# EAGLE design smartwatch (EAGLE 9.7.0)
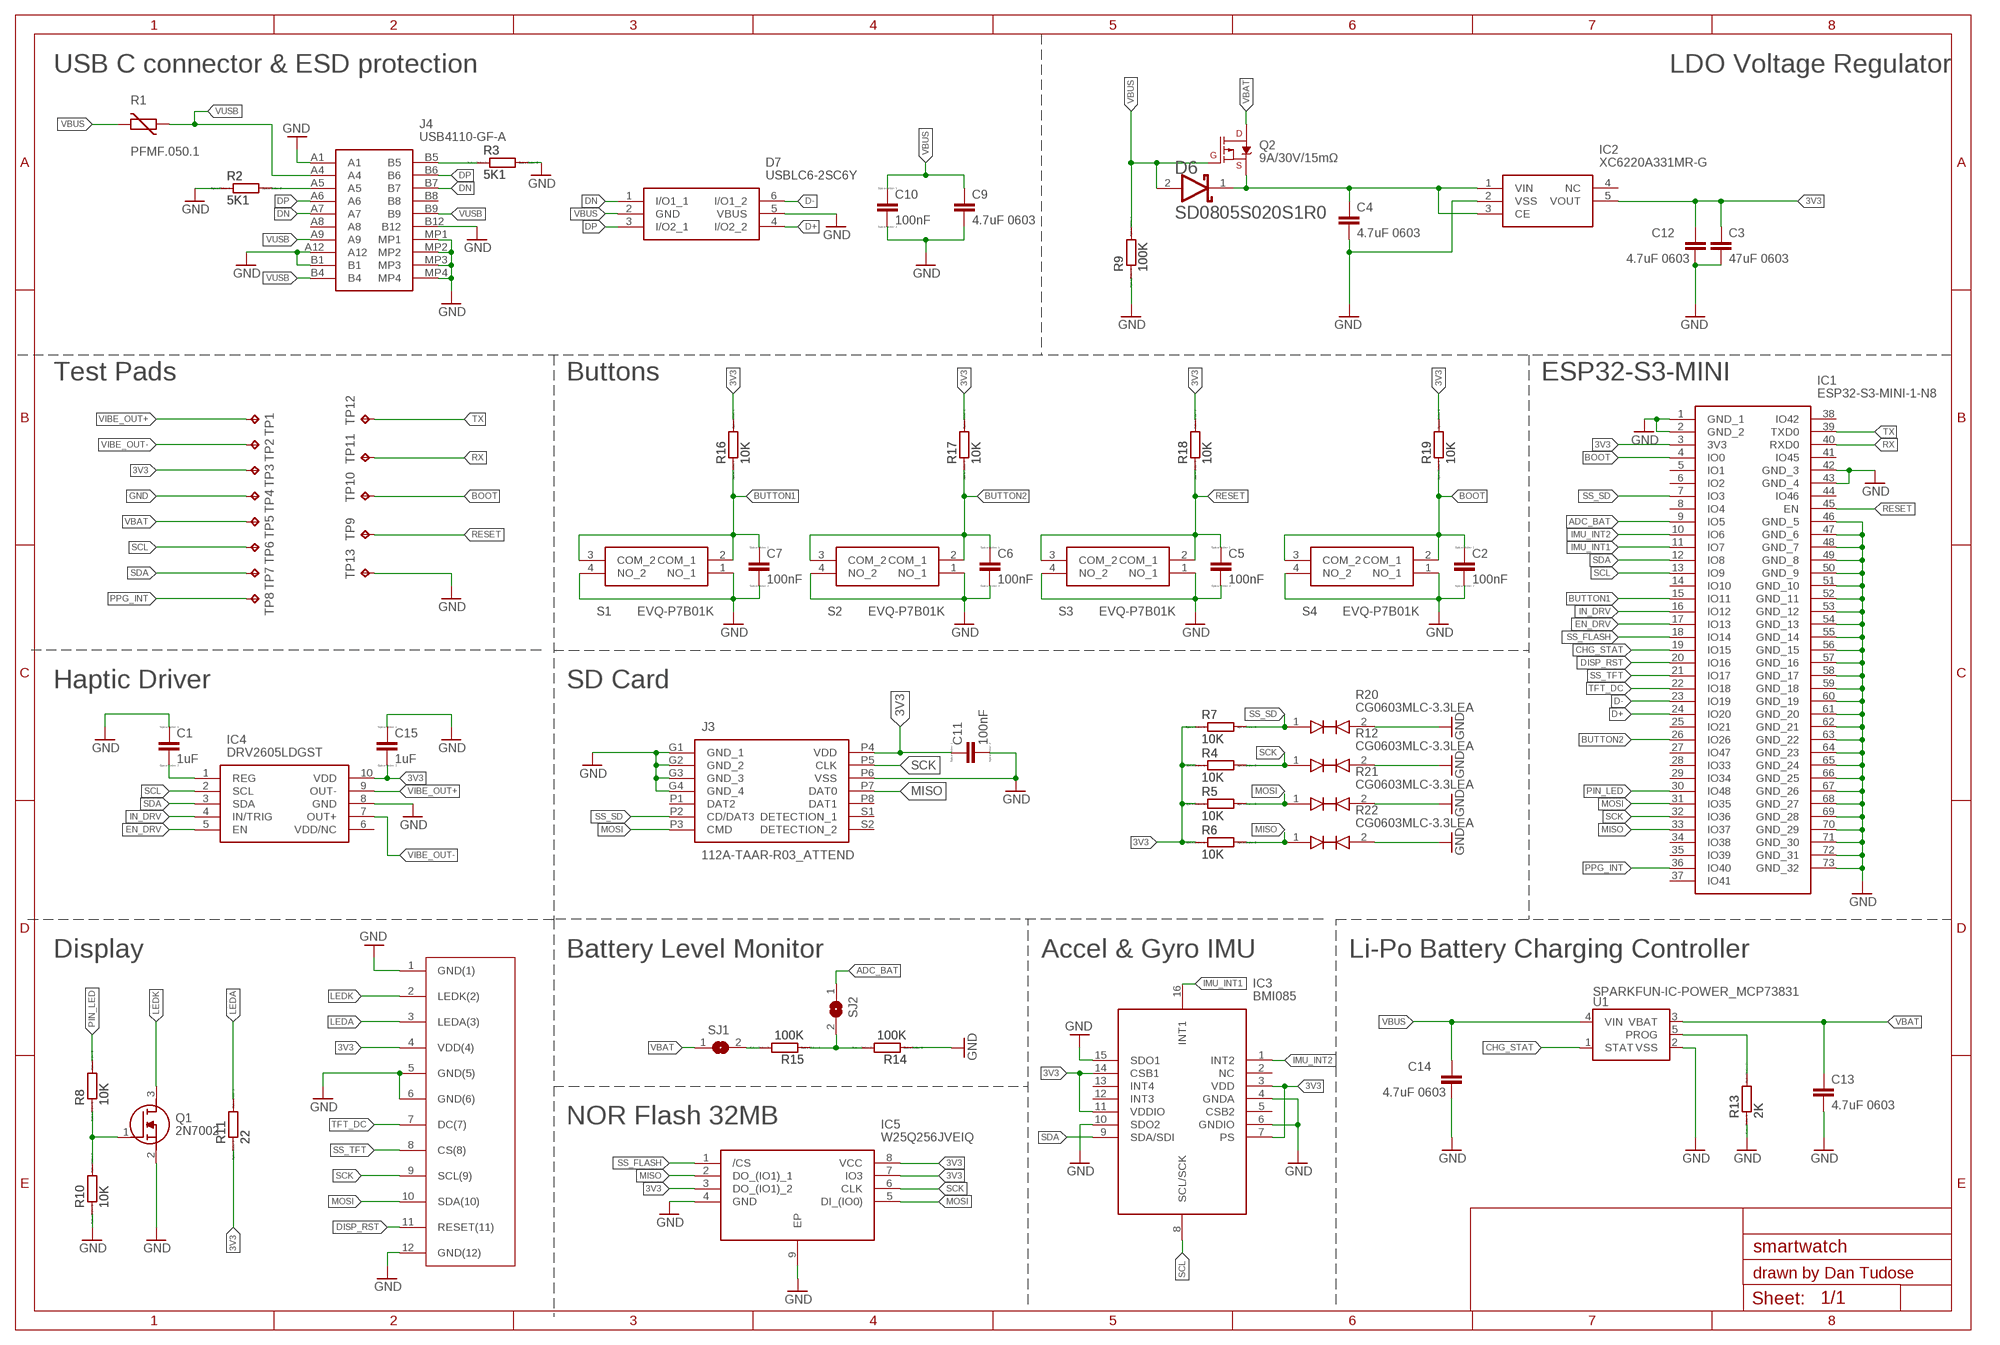
[diagram p0: schematic, sheet 1]

## Parts
C1  1uF  EAGLE-LTSPICE_CC0402  [EAGLE-LTSPICE_C0402]
C2  100nF  EAGLE-LTSPICE_CC0402  [EAGLE-LTSPICE_C0402]
C3  47uF 0603  RCL_C-EUC0603  [RCL_C0603]
C4  4.7uF 0603  RCL_C-EUC0603  [RCL_C0603]
C5  100nF  EAGLE-LTSPICE_CC0402  [EAGLE-LTSPICE_C0402]
C6  100nF  EAGLE-LTSPICE_CC0402  [EAGLE-LTSPICE_C0402]
C7  100nF  EAGLE-LTSPICE_CC0402  [EAGLE-LTSPICE_C0402]
C9  4.7uF 0603  RCL_C-EUC0603  [RCL_C0603]
C10  100nF  EAGLE-LTSPICE_CC0402  [EAGLE-LTSPICE_C0402]
C11  100nF  EAGLE-LTSPICE_CC0402  [EAGLE-LTSPICE_C0402]
C12  4.7uF 0603  RCL_C-EUC0603  [RCL_C0603]
C13  4.7uF 0603  RCL_C-EUC0603  [RCL_C0603]
C14  4.7uF 0603  RCL_C-EUC0603  [RCL_C0603]
C15  1uF  EAGLE-LTSPICE_CC0402  [EAGLE-LTSPICE_C0402]
CON1  LCD_FPC  [LCD_FPC]
D6  AVX---SD0805S020S1R0_AVX_SD0805S020S1R0AVX_SD0805S020S1R0_0_0  [AVX---SD0805S020S1R0_AVX_SD0805S020S1R0_0]
D7  USBLC6-2SC6Y  [SOT95P280X145-6N]
IC1  ESP32-S3-MINI-1-N8  [ESP32S3MINI1N8]
IC2  XC6220A331MR-G  [SOT95P280X120-5N]
IC3  BMI085  [BMI085]
IC4  DRV2605LDGST  [SOP50P490X110-10N]
IC5  W25Q256JVEIQ  [SON127P800X600X80-9N]
J3  112A-TAAR-R03_ATTEND  [112ATAARR03ATTEND]
J4  USB4110-GF-A  [USB4110GFA]
Q1  2N7002  [SOT96P240X120-3N]
Q2  9A/30V/15mΩ  SPARKFUN-DISCRETESEMI_MOSFET_PCH-SI2309DS  [SPARKFUN-DISCRETESEMI_SOT23-3]
R1  PFMF.050.1  VARISTOR_VARISTORCN1812  [VARISTOR_CT/CN1812]
R2  5K1  EAGLE-LTSPICE_RR0402  [EAGLE-LTSPICE_R0402]
R3  5K1  EAGLE-LTSPICE_RR0402  [EAGLE-LTSPICE_R0402]
R4  10K  EAGLE-LTSPICE_RR0402  [EAGLE-LTSPICE_R0402]
R5  10K  EAGLE-LTSPICE_RR0402  [EAGLE-LTSPICE_R0402]
R6  10K  EAGLE-LTSPICE_RR0402  [EAGLE-LTSPICE_R0402]
R7  10K  EAGLE-LTSPICE_RR0402  [EAGLE-LTSPICE_R0402]
R8  10K  EAGLE-LTSPICE_RR0402  [EAGLE-LTSPICE_R0402]
R9  100K  EAGLE-LTSPICE_RR0402  [EAGLE-LTSPICE_R0402]
R10  10K  EAGLE-LTSPICE_RR0402  [EAGLE-LTSPICE_R0402]
R11  22  EAGLE-LTSPICE_RR0402  [EAGLE-LTSPICE_R0402]
R12  CG0603MLC-3.3LEA  [DIONC1608X61N]
R13  2K  EAGLE-LTSPICE_RR0402  [EAGLE-LTSPICE_R0402]
R14  100K  EAGLE-LTSPICE_RR0402  [EAGLE-LTSPICE_R0402]
R15  100K  EAGLE-LTSPICE_RR0402  [EAGLE-LTSPICE_R0402]
R16  10K  EAGLE-LTSPICE_RR0402  [EAGLE-LTSPICE_R0402]
R17  10K  EAGLE-LTSPICE_RR0402  [EAGLE-LTSPICE_R0402]
R18  10K  EAGLE-LTSPICE_RR0402  [EAGLE-LTSPICE_R0402]
R19  10K  EAGLE-LTSPICE_RR0402  [EAGLE-LTSPICE_R0402]
R20  CG0603MLC-3.3LEA  [DIONC1608X61N]
R21  CG0603MLC-3.3LEA  [DIONC1608X61N]
R22  CG0603MLC-3.3LEA  [DIONC1608X61N]
S1  EVQ-P7B01K  [EVQP7B01K]
S2  EVQ-P7B01K  [EVQP7B01K]
S3  EVQ-P7B01K  [EVQP7B01K]
S4  EVQ-P7B01K  [EVQP7B01K]
SJ1  SJ  [SJ]
SJ2  SJ  [SJ]
TP1  TPTP20R  [TP20R]
TP2  TPTP20R  [TP20R]
TP3  TPTP20R  [TP20R]
TP4  TPTP20R  [TP20R]
TP5  TPTP20R  [TP20R]
TP6  TPTP20R  [TP20R]
TP7  TPTP20R  [TP20R]
TP8  TPTP20R  [TP20R]
TP9  TPTP20R  [TP20R]
TP10  TPTP20R  [TP20R]
TP11  TPTP20R  [TP20R]
TP12  TPTP20R  [TP20R]
TP13  TPTP20R  [TP20R]
U1  SPARKFUN-IC-POWER_MCP73831  [SPARKFUN-IC-POWER_SOT23-5]

## Nets
3V3: C3.1 C11.1 C12.1 C15.2 CON1.4(VDD(4)) IC1.3(3V3) IC2.5(VOUT) IC3.3(VDD) IC3.7(PS) IC3.11(VDDIO) IC3.14(CSB1) IC4.10(VDD) IC5.3(DO_(IO1)_2) IC5.7(IO3) IC5.8(VCC) J3.P4(VDD) R4.1 R5.1 R6.1 R7.1 R11.1 R16.2 R17.2 R18.2 R19.2 TP3.TP
ADC_BAT: IC1.9(IO5) SJ2.1
BOOT: C2.1 IC1.4(IO0) R19.1 S4.2(COM_1) S4.3(COM_2) TP10.TP
BUTTON1: C7.1 IC1.15(IO11) R16.1 S1.2(COM_1) S1.3(COM_2)
BUTTON2: C6.1 IC1.26(IO26) R17.1 S2.2(COM_1) S2.3(COM_2)
CHG_STAT: IC1.19(IO15) U1.1(STAT)
D+: D7.4(I/O2_2) IC1.24(IO20)
D-: D7.6(I/O1_2) IC1.23(IO19)
DISP_RST: CON1.11(RESET(11)) IC1.20(IO16)
DN: D7.1(I/O1_1) J4.A7 J4.B7
DP: D7.3(I/O2_1) J4.A6 J4.B6
EN_DRV: IC1.17(IO13) IC4.5(EN)
GND: C1.1 C2.2 C3.2 C4.2 C5.2 C6.2 C7.2 C9.2 C10.2 C11.2 C12.2 C13.2 C14.2 C15.1 CON1.1(GND(1)) CON1.5(GND(5)) CON1.6(GND(6)) CON1.12(GND(12)) D7.5(VBUS) IC1.1(GND_1) IC1.2(GND_2) IC1.42(GND_3) IC1.43(GND_4) IC1.46(GND_5) IC1.47(GND_6) IC1.48(GND_7) IC1.49(GND_8) IC1.50(GND_9) IC1.51(GND_10) IC1.52(GND_11) IC1.53(GND_12) IC1.54(GND_13) IC1.55(GND_14) IC1.56(GND_15) IC1.57(GND_16) IC1.58(GND_17) IC1.59(GND_18) IC1.60(GND_19) IC1.61(GND_20) IC1.62(GND_21) IC1.63(GND_22) IC1.64(GND_23) IC1.65(GND_24) IC1.66(GND_25) IC1.67(GND_26) IC1.68(GND_27) IC1.69(GND_28) IC1.70(GND_29) IC1.71(GND_30) IC1.72(GND_31) IC1.73(GND_32) IC2.2(VSS) IC3.4(GNDA) IC3.6(GNDIO) IC3.10(SDO2) IC3.15(SDO1) IC4.8(GND) IC5.4(GND) IC5.9(EP) J3.G1(GND_1) J3.G2(GND_2) J3.G3(GND_3) J3.G4(GND_4) J3.P6(VSS) J4.A1 J4.A12 J4.B1 J4.B12 J4.MP1 J4.MP2 J4.MP3 J4.MP4 Q1.2(S) R2.1 R3.2 R9.1 R10.1 R12.2 R13.1 R14.1 R20.2 R21.2 R22.2 S1.1(NO_1) S1.4(NO_2) S2.1(NO_1) S2.4(NO_2) S3.1(NO_1) S3.4(NO_2) S4.1(NO_1) S4.4(NO_2) TP4.TP TP13.TP U1.2(VSS)
IMU_INT1: IC1.11(IO7) IC3.16(INT1)
IMU_INT2: IC1.10(IO6) IC3.1(INT2)
IN_DRV: IC1.16(IO12) IC4.4(IN/TRIG)
LEDA: CON1.3(LEDA(3)) R11.2
LEDK: CON1.2(LEDK(2)) Q1.3(D)
MISO: IC1.33(IO37) IC5.2(DO_(IO1)_1) J3.P7(DAT0) R6.2 R22.1
MOSI: CON1.10(SDA(10)) IC1.31(IO35) IC5.5(DI_(IO0)) J3.P3(CMD) R5.2 R21.1
N$1: C1.2 IC4.1(REG)
N$2: C4.1 D6.1(CATHODE) IC2.1(VIN) IC2.3(CE) Q2.2(S)
N$3: J4.A5 R2.2
N$7: R13.2 U1.5(PROG)
N$9: J4.B5 R3.1
N$10: Q1.1(G) R8.1 R10.2
N$14: R14.2 R15.1 SJ2.2
N$16: R15.2 SJ1.2
PIN_LED: IC1.30(IO48) R8.2
PPG_INT: IC1.36(IO40) TP8.TP
RESET: C5.1 IC1.45(EN) R18.1 S3.2(COM_1) S3.3(COM_2) TP9.TP
RX: IC1.40(RXD0) TP11.TP
SCK: CON1.9(SCL(9)) IC1.32(IO36) IC5.6(CLK) J3.P5(CLK) R4.2 R12.1
SCL: IC1.13(IO9) IC3.8(SCL/SCK) IC4.2(SCL) TP6.TP
SDA: IC1.12(IO8) IC3.9(SDA/SDI) IC4.3(SDA) TP7.TP
SS_FLASH: IC1.18(IO14) IC5.1(/CS)
SS_SD: IC1.7(IO3) J3.P2(CD/DAT3) R7.2 R20.1
SS_TFT: CON1.8(CS(8)) IC1.21(IO17)
TFT_DC: CON1.7(DC(7)) IC1.22(IO18)
TX: IC1.39(TXD0) TP12.TP
VBAT: C13.1 Q2.3(D) SJ1.1 TP5.TP U1.3(VBAT)
VBUS: C9.1 C10.1 C14.1 D6.2(ANODE) D7.2(GND) Q2.1(G) R1.2 R9.2 U1.4(VIN)
VIBE_OUT+: IC4.9(OUT-) TP1.TP
VIBE_OUT-: IC4.7(OUT+) TP2.TP
VUSB: J4.A4 J4.A9 J4.B4 J4.B9 R1.1
Unconnected: IC1.5(IO1) IC1.6(IO2) IC1.8(IO4) IC1.14(IO10) IC1.25(IO21) IC1.27(IO47) IC1.28(IO33) IC1.29(IO34) IC1.34(IO38) IC1.35(IO39) IC1.37(IO41) IC1.38(IO42) IC1.41(IO45) IC1.44(IO46) IC2.4(NC) IC3.2(NC) IC3.5(CSB2) IC3.12(INT3) IC3.13(INT4) IC4.6(VDD/NC) J3.P1(DAT2) J3.P8(DAT1) J3.S1(DETECTION_1) J3.S2(DETECTION_2) J4.A8 J4.B8

## Notes on the sheet
- USB C connector & ESD protection | LDO Voltage Regulator
- Test Pads | Buttons | ESP32-S3-MINI
- Haptic Driver | SD Card
- Display | Battery Level Monitor | Accel & Gyro IMU | Li-Po Battery Charging Controller
- NOR Flash 32MB
- drawn by Dan Tudose

## Library data of the parts
C1 C2 C5-C7 C10 C11 C15 = Hector_Watch:EAGLE-LTSPICE_C: CAPACITOR, European symbol; SPICEMODEL: NONE; SPICEPREFIX: C
C3 C4 C9 C12-C14 = Hector_Watch:RCL_C-EU: CAPACITOR, European symbol; SPICEPREFIX: C
CON1 = Hector_Watch:LCD_FPC
D6 = Hector_Watch:AVX---SD0805S020S1R0_AVX_SD0805S020S1R0: Schottky Barrier Rectifier Diode; CENTROID_NOT_SPECIFIED: No; DATASHEET: http://datasheets.avx.com/schottky.pdf; DIGIKEY_DESCRIPTION: DIODE SCHOTTKY 20V 1A 0805; DIGIKEY_PART_NUMBER: 478-7800-1-ND; LEAD_FREE: yes; MF: AVX; MOUSER_PART_NUMBER: 581-SD0805S020S1R0; MPN: SD0805S020S1R0; PACKAGE: 0805 (2012 metric); PREFIX: D; ROHS: yes; TEMPERATURE_RANGE_HIGH: +125°C; TEMPERATURE_RANGE_LOW: -55°C
D7 = Hector_Watch:USBLC6-2SC6Y: Low Cap. ESD Protection Auto SOT-23-6 STMicroelectronics USBLC6-2SC6Y, Dual Uni-Directional TVS Diode Array, 6-Pin SOT-23 Source: Datasheet <https://componentsearchengine.com/Datasheets/1/USBLC6-2SC6Y.pdf>; ARROW_PART_NUMBER: USBLC6-2SC6Y; ARROW_PRICE-STOCK: https://www.arrow.com/en/products/usblc6-2sc6y/stmicroelectronics?region=nac; DESCRIPTION: Low Cap. ESD Protection Auto SOT-23-6 STMicroelectronics USBLC6-2SC6Y, Dual Uni-Directional TVS Diode Array, 6-Pin SOT-23; HEIGHT: 1.45mm; MANUFACTURER_NAME: STMicroelectronics; MANUFACTURER_PART_NUMBER: USBLC6-2SC6Y; MOUSER_PART_NUMBER: 511-USBLC6-2SC6Y; MOUSER_PRICE-STOCK: https://www.mouser.co.uk/ProductDetail/STMicroelectronics/USBLC6-2SC6Y?qs=gNDSiZmRJS%2FOgDexvXkdow%3D%3D
IC1 = Hector_Watch:ESP32-S3-MINI-1-N8: WiFi Development Tools - 802.11 [Engineering Samples] SMD Module, ESP32-S3FN8, 8 MB SPI Flash, PCB Antenna Source: Datasheet <https://www.espressif.com/sites/default/files/documentation/esp32-s3-mini-1_mini-1u_datasheet_en.pdf>; DESCRIPTION: WiFi Development Tools - 802.11 [Engineering Samples] SMD Module, ESP32-S3FN8, 8 MB SPI Flash, PCB Antenna; HEIGHT: 2.55mm; MANUFACTURER_NAME: Espressif Systems; MANUFACTURER_PART_NUMBER: ESP32-S3-MINI-1-N8; MOUSER_PART_NUMBER: 356-ESP32-S3-MINI1N8; MOUSER_PRICE-STOCK: https://www.mouser.co.uk/ProductDetail/Espressif-Systems/ESP32-S3-MINI-1-N8?qs=XAiT9M5g4x82rl6F%2FIYUQg%3D%3D
IC2 = Hector_Watch:XC6220A331MR-G: LDO Voltage Regulators Source: Datasheet <https://www.torexsemi.com/file/xc6220/XC6220.pdf>; DESCRIPTION: LDO Voltage Regulators; HEIGHT: 1.2mm; MANUFACTURER_NAME: Torex; MANUFACTURER_PART_NUMBER: XC6220A331MR-G; MOUSER_PART_NUMBER: 865-XC6220A331MR-G; MOUSER_PRICE-STOCK: https://www.mouser.co.uk/ProductDetail/Torex-Semiconductor/XC6220A331MR-G?qs=AsjdqWjXhJ8ZSWznL1J0gg%3D%3D
IC3 = Hector_Watch:BMI085: IMUs - Inertial Measurement Units High-performance IMU BMI085 for virtual and augmented reality applications Source: Datasheet <https://ae-bst.resource.bosch.com/media/_tech/media/datasheets/BST-BMI085-DS001.pdf>; ARROW_PART_NUMBER: BMI085; ARROW_PRICE-STOCK: https://www.arrow.com/en/products/bmi085/bosch; DESCRIPTION: IMUs - Inertial Measurement Units High-performance IMU BMI085 for virtual and augmented reality applications; HEIGHT: 1mm; MANUFACTURER_NAME: BOSCH; MANUFACTURER_PART_NUMBER: BMI085; MOUSER_PART_NUMBER: 262-BMI085; MOUSER_PRICE-STOCK: https://www.mouser.co.uk/ProductDetail/Bosch-Sensortec/BMI085?qs=y6ZabgHbY%252ByGCM8LfWZyqA%3D%3D
IC4 = Hector_Watch:DRV2605LDGST: ERM & LRA Device Haptic Driver 2-5V BGA9 Texas Instruments DRV2605LDGST Piezo Haptic Motor Driver IC, 5 V, 10-Pin VSSOP Source: Datasheet <http://www.ti.com/lit/ds/symlink/drv2605l.pdf>; ARROW_PART_NUMBER: DRV2605LDGST; ARROW_PRICE-STOCK: https://www.arrow.com/en/products/drv2605ldgst/texas-instruments?region=nac; DESCRIPTION: ERM & LRA Device Haptic Driver 2-5V BGA9 Texas Instruments DRV2605LDGST Piezo Haptic Motor Driver IC, 5 V, 10-Pin VSSOP; HEIGHT: 1.1mm; MANUFACTURER_NAME: Texas Instruments; MANUFACTURER_PART_NUMBER: DRV2605LDGST; MOUSER_PART_NUMBER: 595-DRV2605LDGST; MOUSER_PRICE-STOCK: https://www.mouser.co.uk/ProductDetail/Texas-Instruments/DRV2605LDGST?qs=asCBFxFfL1TjvcNdZsR2BA%3D%3D
IC5 = Hector_Watch:W25Q256JVEIQ: 256M-bit Serial Flash Memory with uniform 4KB sectors and Dual/Quad SPI Source: Datasheet <https://www.winbond.com/hq/search-resource-file.jsp?partNo=W25Q256JVEIQ&type=datasheet>; ARROW_PART_NUMBER: W25Q256JVEIQ; ARROW_PRICE-STOCK: https://www.arrow.com/en/products/w25q256jveiq/winbond-electronics?region=nac; DESCRIPTION: 256M-bit Serial Flash Memory with uniform 4KB sectors and Dual/Quad SPI; HEIGHT: 0.8mm; MANUFACTURER_NAME: Winbond; MANUFACTURER_PART_NUMBER: W25Q256JVEIQ; MOUSER_PART_NUMBER: 454-W25Q256JVEIQ; MOUSER_PRICE-STOCK: https://www.mouser.co.uk/ProductDetail/Winbond/W25Q256JVEIQ?qs=qSfuJ%252Bfl%2Fd4o%2FNFUf7yCgA%3D%3D
J3 = Hector_Watch:112A-TAAR-R03_ATTEND: Micro SD Card Socket, Push-Push Type, Top Mount, SMT, H=1.83mm, 10u Source: Datasheet <https://www.attend.com.tw/data/download/file/112A-TAAR-R03.pdf>; DESCRIPTION: Micro SD Card Socket, Push-Push Type, Top Mount, SMT, H=1.83mm, 10u; HEIGHT: 1.9mm; MANUFACTURER_NAME: ATTEND; MANUFACTURER_PART_NUMBER: 112A-TAAR-R03 ATTEND
J4 = Hector_Watch:USB4110-GF-A: CONN USB 2.0 TYPE-C R/A SMT Source: Datasheet <https://gct.co/files/drawings/usb4110.pdf>; DESCRIPTION: CONN USB 2.0 TYPE-C R/A SMT; HEIGHT: 3.26mm; MANUFACTURER_NAME: GCT (GLOBAL CONNECTOR TECHNOLOGY); MANUFACTURER_PART_NUMBER: USB4110-GF-A; MOUSER_PART_NUMBER: 640-USB4110-GF-A; MOUSER_PRICE-STOCK: https://www.mouser.co.uk/ProductDetail/GCT/USB4110-GF-A?qs=KUoIvG%2F9IlYiZvIXQjyJeA%3D%3D
Q1 = Hector_Watch:2N7002: N-channel MOSFET,2N7002 0.115A 60V Source: Datasheet <https://www.onsemi.com/pub/Collateral/NDS7002A-D.PDF>; ARROW_PART_NUMBER: 2N7002; ARROW_PRICE-STOCK: https://www.arrow.com/en/products/2n7002/on-semiconductor?region=europe; DESCRIPTION: N-channel MOSFET,2N7002 0.115A 60V; HEIGHT: 1.2mm; MANUFACTURER_NAME: onsemi; MANUFACTURER_PART_NUMBER: 2N7002; MOUSER_PART_NUMBER: 512-2N7002; MOUSER_PRICE-STOCK: https://www.mouser.co.uk/ProductDetail/onsemi-Fairchild/2N7002?qs=0dwsXDNhqlz66WJJhrTFjQ%3D%3D
Q2 = Hector_Watch:SPARKFUN-DISCRETESEMI_MOSFET_PCH: P-channel MOSFETs Voltage controlled devices that allow control of high current outputs. SparkFun Products: SparkFun ESP32 Thing <https://www.sparkfun.com/products/13907> SparkFun ESP8266 Thing <https://www.sparkfun.com/products/13231> SparkFun Pi Servo HAT V2 <https://www.sparkfun.com/products/15316> DMG2305UX-7 (20V/4.2A/SOT23-3); PROD_ID: TRANS-14715
R1 = Hector_Watch:VARISTOR_VARISTOR: VARISTOR
R2-R11 R13-R19 = Hector_Watch:EAGLE-LTSPICE_R: RESISTOR, European symbol; SPICEMODEL: NONE; SPICEPREFIX: R
R12 R20-R22 = Library:CG0603MLC-3.3LEA: ESD Suppressors / TVS Diodes CHIP GUARD 3.3VOLT LOW LEAKAGE Source: Datasheet <https://www.arrow.com/en/products/cg0603mlc-3.3lea/bourns?region=nac>; ARROW_PART_NUMBER: CG0603MLC-3.3LEA; ARROW_PRICE-STOCK: https://www.arrow.com/en/products/cg0603mlc-3.3lea/bourns?region=nac; DESCRIPTION: ESD Suppressors / TVS Diodes CHIP GUARD 3.3VOLT LOW LEAKAGE; HEIGHT: 0.61mm; MANUFACTURER_NAME: Bourns; MANUFACTURER_PART_NUMBER: CG0603MLC-3.3LEA; MOUSER_PART_NUMBER: 652-CG0603MLC-3.3LEA; MOUSER_PRICE-STOCK: https://www.mouser.co.uk/ProductDetail/Bourns/CG0603MLC-3.3LEA?qs=esutdnBN8g31ZVMaCTwuKA%3D%3D
S1-S4 = Hector_Watch:EVQ-P7B01K: Black Push Plate Tactile Switch, SPST-NO 50 mA 1.35mm Source: Datasheet <https://componentsearchengine.com/Datasheets/2/EVQP7B01K.pdf>; DESCRIPTION: Black Push Plate Tactile Switch, SPST-NO 50 mA 1.35mm; HEIGHT: 1.35mm; MANUFACTURER_NAME: Panasonic; MANUFACTURER_PART_NUMBER: EVQ-P7B01K; MOUSER_PART_NUMBER: 667-EVQ-P7B01K; MOUSER_PRICE-STOCK: https://www.mouser.co.uk/ProductDetail/Panasonic/EVQ-P7B01K?qs=Ow%252BOiPmaljGz0yYR%252BWV0ZQ%3D%3D
SJ1 SJ2 = jumper:SJ: SMD solder JUMPER
TP1-TP3 TP5-TP12 = Hector_Watch:TP: Test pad
TP4 TP13 = Hector_Watch:TP: Test pad; SPICEPREFIX: X
U1 = Hector_Watch:SPARKFUN-IC-POWER_MCP73831: MCP73831T Li-Ion, Li-Pol Controller Miniature single cell, fully integrated Li-Ion, Li-polymer charge management controller Datasheet <http://ww1.microchip.com/downloads/en/DeviceDoc/20001984g.pdf> SparkFun Products: SparkFun ESP32 Thing <https://www.sparkfun.com/products/13907> SparkFun 9DoF Razor IMU M0 <https://www.sparkfun.com/products/14001>; PROD_ID: IC-09995

## Net classes
0 default: width 0.152 mm, drill 0.305 mm, clearance 0.152 mm

## Board
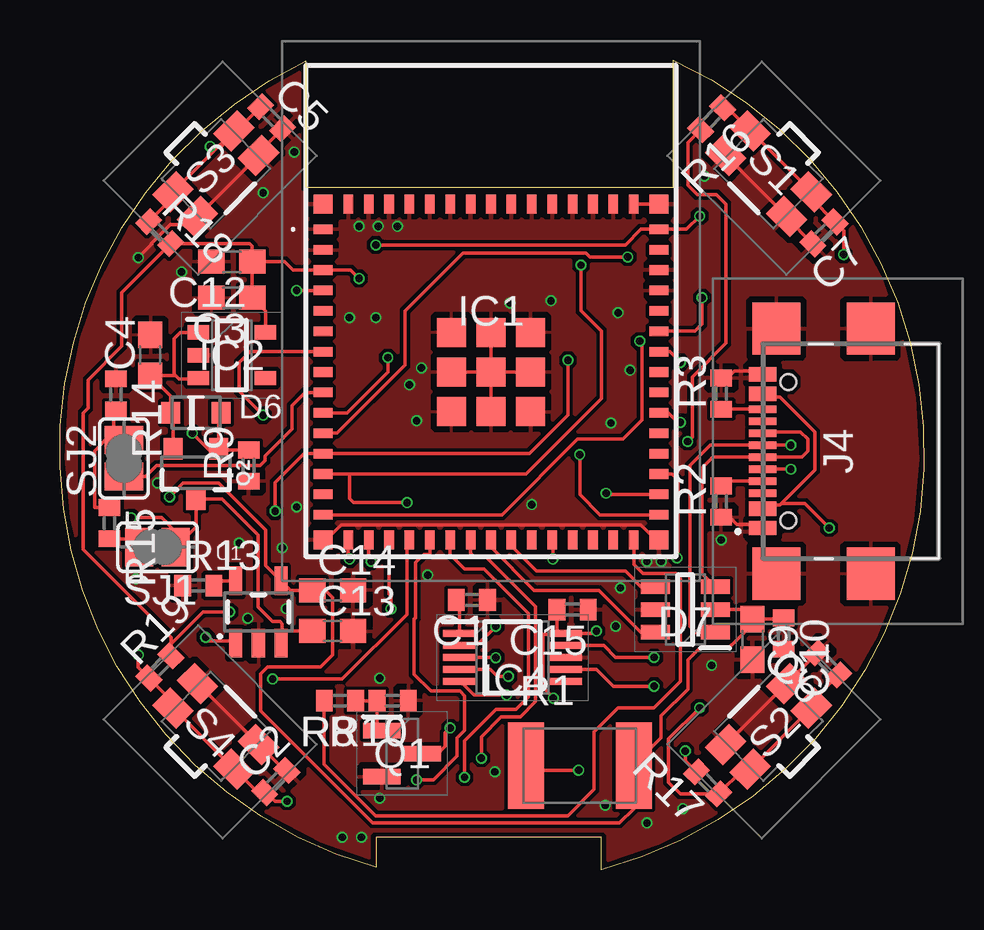
[diagram p1: board, top side]
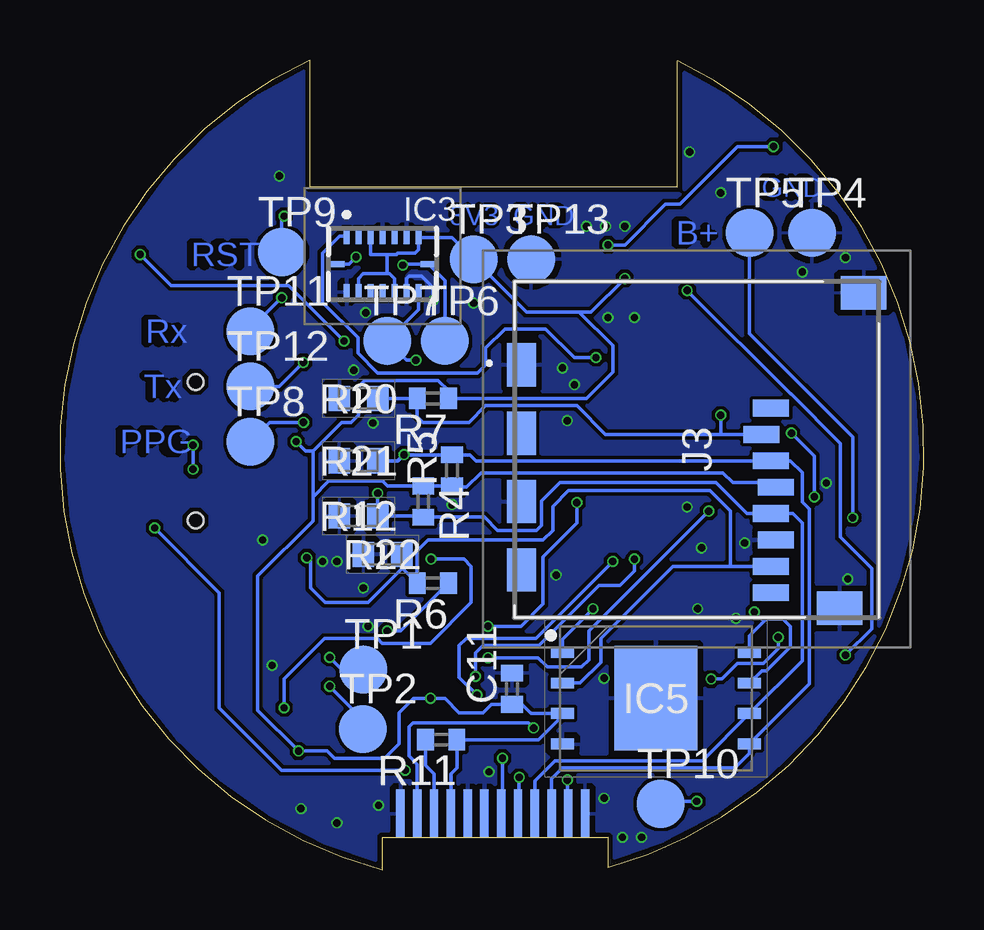
[diagram p2: board, bottom side, seen from below]

Size 36.01 x 33.75 mm. Coordinates in mm from the lower left corner, seen from the top.
Outline: 10.27,28.44 25.58,28.44 25.58,33.75 arc-141 22.57,0 22.57,1.34 13.17,1.34 13.17,0.1 arc-139 10.27,33.71 10.27,28.44
Copper layers (1*16): Top / Bottom
Stack-up Default Layer Stack: Top User Defined 0.035mm / Dielectric-1 User Defined 1.6mm / Bottom User Defined 0.035mm
Design rules: minimum copper width class=0 6mil, minimum copper width 5mil, minimum drill size class=0 12mil, minimum drill size 0.3mm, copper clearance class=0 to class=0 6mil, copper clearance wire_polygon to wire_polygon 5mil, copper clearance wire_polygon to pad_smd 5mil, copper clearance wire_polygon to via 5mil, copper clearance pad_smd to pad_smd 5mil, copper clearance pad_smd to via 5mil, copper clearance via to via 5mil, copper clearance smd to pad (same net) 5mil, copper clearance smd to via (same net) 5mil, copper clearance smd to smd (same net) 5mil, dimension clearance 0.2mm, via restrict clearance 0mil, restrict clearance 0mil, drill distance 6mil, keepout clearance 0mil
tRestrict: area 13.2,-1.6 to 22.6,1.3
bRestrict: area 13.2,-1.2 to 22.6,1.3

### Footprints (pad centres in the part's own frame; a part is rotated, then mirrored left to right if it is on the bottom)
EAGLE-LTSPICE_C0402 = smd 0.7 x 0.9: 1 -0.65,0; 2 0.65,0
RCL_C0603 = smd 1.1 x 1: 1 -0.85,0; 2 0.85,0
LCD_FPC = smd 0.35 x 2: 1 3.85,0; 2 3.15,0; 3 2.45,0; 4 1.75,0; 5 1.05,0; 6 0.35,0; 7 -0.35,0; 8 -1.05,0; 9 -1.75,0; 10 -2.45,0; 11 -3.15,0; 12 -3.85,0
AVX---SD0805S020S1R0_AVX_SD0805S020S1R0_0 = smd 0.8 x 0.9: 1 -1.05,0; 2 1.05,0
SOT95P280X145-6N = smd 1.2 x 0.6: 1 -1.25,0.95; 2 -1.25,0; 3 -1.25,-0.95; 4 1.25,-0.95; 5 1.25,0; 6 1.25,0.95
ESP32S3MINI1N8 = smd 0.8 x 0.4: 1 -7,5.95; 2 -7,5.1; 3 -7,4.25; 4 -7,3.4; 5 -7,2.55; 6 -7,1.7; 7 -7,0.85; 8 -7,0; 9 -7,-0.85; 10 -7,-1.7; 11 -7,-2.55; 12 -7,-3.4; 13 -7,-4.25; 14 -7,-5.1; 15 -7,-5.95; 31 7,-5.95; 32 7,-5.1; 33 7,-4.25; 34 7,-3.4; 35 7,-2.55; 36 7,-1.7; 37 7,-0.85; 38 7,0; 39 7,0.85; 40 7,1.7; 41 7,2.55; 42 7,3.4; 43 7,4.25; 44 7,5.1; 45 7,5.95 | smd 0.4 x 0.8: 16 -5.95,-7; 17 -5.1,-7; 18 -4.25,-7; 19 -3.4,-7; 20 -2.55,-7; 21 -1.7,-7; 22 -0.85,-7; 23 0,-7; 24 0.85,-7; 25 1.7,-7; 26 2.55,-7; 27 3.4,-7; 28 4.25,-7; 29 5.1,-7; 30 5.95,-7; 46 5.95,7; 47 5.1,7; 48 4.25,7; 49 3.4,7; 50 2.55,7; 51 1.7,7; 52 0.85,7; 53 0,7; 54 -0.85,7; 55 -1.7,7; 56 -2.55,7; 57 -3.4,7; 58 -4.25,7; 59 -5.1,7; 60 -5.95,7 | smd 1.2 x 1.2: 61 0,0; 66 -1.65,1.65; 67 -1.65,0; 68 -1.65,-1.65; 69 0,-1.65; 70 1.65,-1.65; 71 1.65,0; 72 1.65,1.65; 73 0,1.65 | smd 0.8 x 0.8: 62 -7,7; 63 -7,-7; 64 7,-7; 65 7,7
SOT95P280X120-5N = smd 0.9 x 0.6: 1 -1.4,0.95; 2 -1.4,0; 3 -1.4,-0.95; 4 1.4,-0.95; 5 1.4,0.95
BMI085 = smd 0.675 x 0.25: 1 1.165,1.5; 2 1.165,1; 3 1.165,0.5; 4 1.165,0; 5 1.165,-0.5; 6 1.165,-1; 7 1.165,-1.5; 9 -1.165,-1.5; 10 -1.165,-1; 11 -1.165,-0.5; 12 -1.165,0; 13 -1.165,0.5; 14 -1.165,1; 15 -1.165,1.5 | smd 0.25 x 0.675: 8 0,-1.915; 16 0,1.915
SOP50P490X110-10N = smd 1.4 x 0.3: 1 -2.2,1; 2 -2.2,0.5; 3 -2.2,0; 4 -2.2,-0.5; 5 -2.2,-1; 6 2.2,-1; 7 2.2,-0.5; 8 2.2,0; 9 2.2,0.5; 10 2.2,1
SON127P800X600X80-9N = smd 0.95 x 0.45: 1 -3.9,1.905; 2 -3.9,0.635; 3 -3.9,-0.635; 4 -3.9,-1.905; 5 3.9,-1.905; 6 3.9,-0.635; 7 3.9,0.635; 8 3.9,1.905 | smd 3.45 x 4.35: 9 0,0
112ATAARR03ATTEND = smd 1.8 x 1.2: G1 10.6,10.4; G2 4.9,10.4; S1 7.75,10.4; S2 2.05,10.4 | smd 1.4 x 1.9: G3 13.6,-3.85; G4 0.45,-2.85 | smd 0.7 x 1.5: P1 8.8,0; P2 7.7,0.4; P3 6.6,0; P4 5.5,-0.2; P5 4.4,0; P6 3.3,-0.2; P7 2.2,0; P8 1.1,0
USB4110GFA = smd 0.3 x 1.15: A1 -3.35,3.678; A4 -2.55,3.678; A5 -1.25,3.678; A6 -0.25,3.678; A7 0.25,3.678; A8 1.25,3.678; A9 2.55,3.678; A12 3.35,3.678; B1 3.05,3.678; B4 2.25,3.678; B5 1.75,3.678; B6 0.75,3.678; B7 -0.75,3.678; B8 -1.75,3.678; B9 -2.25,3.678; B12 -3.05,3.678 | smd 2.18 x 2: MP1 -5.11,-0.827; MP2 5.11,-0.827; MP3 -5.11,3.103; MP4 5.11,3.103 | hole 0.65: -2.89,2.603; 2.89,2.603
SOT96P240X120-3N = smd 1.55 x 0.65: 1 -0.85,0.96; 2 -0.85,-0.96; 3 0.85,0
SPARKFUN-DISCRETESEMI_SOT23-3 = smd 0.8 x 0.9: 1 -0.95,-1; 2 0.95,-1; 3 0,1.1
VARISTOR_CT/CN1812 = smd 1.5 x 3.6: 1 -2.25,0; 2 2.25,0
EAGLE-LTSPICE_R0402 = smd 0.7 x 0.9: 1 -0.65,0; 2 0.65,0
DIONC1608X61N = smd 0.9 x 1.05: 1 -0.8,0; 2 0.8,0
EVQP7B01K = smd 1.4 x 1.05: 1 -1.8,1.05; 2 -1.8,-0.4; 3 1.8,-0.4; 4 1.8,1.05
SJ = smd 1.168 x 1.6: 1 -0.762,0; 2 0.762,0
TP20R = smd 2 x 2: TP 0,0
SPARKFUN-IC-POWER_SOT23-5 = smd 0.55 x 1.2: 1 -0.95,-1.3; 2 0,-1.3; 3 0.95,-1.3; 4 0.95,1.3; 5 -0.95,1.3

### Placement (x,y rotation side)
C1  17.17,11.24 180 top
C2  9,3.67 45 top
C3  7.17,23.84 180 top
C4  3.77,21.44 90 top
C5  8.82,31.35 315 top
C6  32,8.57 135 top
C7  31.85,26.54 225 top
C9  28.87,9.6 270 top
C10  30.17,9.84 270 top
C11  17.17,7.54 90 bottom
C12  7.17,25.34 180 top
C13  11.37,9.94 0 top
C14  11.37,11.64 0 top
C15  21.37,10.84 180 top
CON1  17.97,2.34 180 bottom
D6  5.67,19.04 0 top
D7  26.07,10.84 180 top
IC1  17.97,20.74 0 top
IC2  7.17,21.44 0 top
IC3  22.57,25.24 90 bottom
IC4  18.86,8.84 0 top
IC5  11.17,7.14 0 bottom
J3  6.37,10.44 90 bottom
J4  32.97,17.44 90 top
Q1  14.27,4.84 0 top
Q2  5.67,16.54 180 top
R1  21.67,4.34 0 top
R2  27.57,15.34 90 top
R3  27.57,19.84 90 top
R4  20.87,15.34 270 bottom
R5  19.67,16.64 90 bottom
R6  20.47,11.94 180 bottom
R7  20.47,19.64 180 bottom
R8  11.67,7.04 180 top
R9  7.87,16.84 90 top
R10  13.87,7.04 180 top
R11  20.12,5.42 180 bottom
R12  23.57,14.74 180 bottom
R13  5.77,11.84 0 top
R14  2.33,19.81 270 top
R15  2.07,14.44 270 top
R16  27.17,31.3 225 top
R17  27,3.61 135 top
R18  4.15,26.56 315 top
R19  4.17,8.44 45 top
R20  23.57,19.64 180 bottom
R21  23.57,17.04 180 bottom
R22  22.57,13.14 180 bottom
S1  29.77,29.24 135 top
S2  29.77,5.74 45 top
S3  6.27,29.24 225 top
S4  6.27,5.74 315 top
SJ1  4.07,13.44 180 top
SJ2  2.67,17.14 90 top
TP1  23.37,8.34 0 bottom
TP2  23.39,5.87 0 bottom
TP3  18.77,25.44 0 bottom
TP4  4.67,26.54 0 bottom
TP5  7.27,26.54 0 bottom
TP6  19.97,22.04 0 bottom
TP7  22.37,22.04 0 bottom
TP8  28.07,17.84 0 bottom
TP9  26.77,25.74 0 bottom
TP10  10.97,2.74 0 bottom
TP11  28.07,22.44 0 bottom
TP12  28.07,20.14 0 bottom
TP13  16.37,25.44 0 bottom
U1  8.27,10.74 0 top

### Tracks (layer width: path | path; a pad name or v marks a point on that pad's centre or on a via)
3V3  (via drill 0.3)
  Top 0.152: C12.1 C3.1 8.57,23.29 IC2.5 | C12.1 9.37,25.34 9.72,24.99 IC1.3 12.12,24.99 v12.47,24.64 | C12.1 8.02,25.99 7.91,26.1 R18.2 2.57,24.05 2.57,21.82 1.17,20.42 1.17,19.24 0.97,19.04 0.97,13.34 4.63,9.68 R19.2 4.63,9.4 5.97,10.74 v7.07,10.74 | v22.37,9.94 22.27,9.84 IC4.10 21.03,9.81 20.77,9.81 | v20.57,7.14 20.57,7.17 20.14,7.6 20.14,9.81 20.77,9.81 | C15.2 20.72,9.86 20.77,9.81 | R17.2 26.07,4.54 v26.07,4.94 | R16.2 26.17,30.3 26.17,28.54 26.57,28.14 27.37,28.14 27.77,27.74 27.77,21.94 26.37,20.54 26.37,18.04 v26.17,17.84
  Bottom 0.152: J3.P4 6.37,16.14 7.97,16.14 8.37,16.54 18.47,16.54 19.07,15.94 19.62,15.94 R5.1 R4.1 22.36,15.99 22.56,16.19 24.82,16.19 25.47,15.54 | IC3.3 23.07,25.64 22.37,25.64 | IC3.14 23.57,24.64 23.37,24.84 22.37,24.84 | IC3.11 22.07,24.63 22.28,24.84 22.37,24.84 | 22.37,25.64 22.37,24.84 | IC3.7 21.07,26.34 | 21.07,26.34 21.07,25.84 21.21,25.7 21.93,25.7 21.99,25.64 22.37,25.64 | CON1.4 19.72,3.99 19.47,4.24 R11.1 16.49,5.42 16.48,5.4 16.06,5.4 15.18,6.28 15.18,6.63 IC5.3 16.37,6.51 16.75,6.89 C11.1 18.02,6.89 18.37,6.54 19.37,6.54 19.97,7.14 v20.57,7.14 21.27,7.14 21.87,6.54 21.87,5.24 22.47,4.64 24.56,4.64 24.87,4.94 v26.07,4.94 27.77,6.64 27.77,12.24 25.47,14.54 25.47,15.54 | IC5.7 6.76,8.29 6.57,8.29 5.57,9.29 5.57,10.14 5.87,10.44 6.57,10.44 | 6.57,10.44 7.27,9.74 IC5.8 | v7.07,10.74 6.77,10.44 6.57,10.44 | R6.1 21.82,9.94 v22.37,9.94 | 21.07,26.34 19.67,26.34 TP3.TP 16.57,23.24 14.37,23.24 | 14.37,23.24 12.97,21.84 12.97,20.74 14.07,19.64 R7.1 19.82,19.97 20.25,20.4 23.31,20.4 23.57,20.14 23.57,18.94 23.87,18.64 24.27,18.64 25.47,17.44 | v12.47,24.64 13.87,23.24 14.37,23.24 | 25.47,17.44 25.47,15.54 | v26.17,17.84 25.77,17.44 25.47,17.44
ADC_BAT
  Top 0.152: IC1.9 10.22,19.89 9.67,19.34 9.67,18.37 8.55,17.25 8.55,17.05 8.34,16.84 4.04,16.84 3.57,16.38 SJ2.1
BOOT  (via drill 0.3)
  Top 0.152: IC1.4 v9.87,24.14 | v3.27,8.94 3.27,8.42 R19.1 4.71,6.98 S4.2 S4.3 8.23,3.21 C2.1 8.6,3.21 8.97,2.84 v9.47,2.84
  Bottom 0.152: v9.87,24.14 5.55,19.82 5.52,19.82 3.47,17.77 3.47,13.86 2.17,12.56 2.17,10.04 v3.27,8.94 | TP10.TP 10.87,2.84 v9.47,2.84
BUTTON1  (via drill 0.3)
  Top 0.152: R16.1 27.81,31.76 S1.3 S1.2 31.32,27.99 C7.1 32.67,26.65 v32.67,25.64 | IC1.15 18.42,14.79 21.57,17.94 23.47,17.94 24.27,18.75 24.27,21.94 v24.17,22.04
  Bottom 0.152: v32.67,25.64 31.37,24.34 26.48,24.34 v24.17,22.04
BUTTON2  (via drill 0.3)
  Top 0.152: C6.1 31.32,6.98 S2.3 S2.2 28.49,4.19 R17.1 25.86,3.15 25.37,3.64 25.37,5.44 v26.67,6.74 | IC1.26 20.54,13.72 v20.54,12.95
  Bottom 0.152: v26.67,6.74 26.67,7.94 24.97,9.64 22.77,9.64 22.58,9.44 20.57,9.44 18.87,11.14 18.87,12.64 19.17,12.94 v20.54,12.94 v20.54,12.95
CHG_STAT  (via drill 0.3)
  Top 0.152: IC1.19 14.47,13.64 14.47,10.64 11.77,7.94 v8.87,7.94 | U1.1 7.22,9.54 6.21,9.54 v6.07,9.69
  Bottom 0.152: v8.87,7.94 8.43,7.94 7.77,8.59 6.7,8.59 6.07,9.22 v6.07,9.69
D+
  Top 0.152: IC1.24 18.82,13.49 19.87,12.44 23.57,12.44 24.22,11.79 D7.4
D-
  Top 0.152: IC1.23 17.97,13.44 19.77,11.64 22.47,11.64 24.22,9.89 D7.6
DISP_RST  (via drill 0.3)
  Top 0.152: v14.86,3.74 14.87,3.74 15.57,3.74 16.56,4.74 16.56,5.49 16.87,5.8 16.87,7.24 16.67,7.44 15.47,7.44 14.77,8.14 14.77,10.44 14.83,10.5 14.83,12.8 15.17,13.14 15.37,13.14 15.42,13.19 IC1.20
  Bottom 0.152: CON1.11 14.86,2.39 v14.86,3.74
DN  (via drill 0.3)
  Top 0.152: D7.1 26.52,9.89 26.27,10.14 26.27,16.84 27.12,17.69 J4.A7 v30.46,17.69 v30.47,17.7 | v30.47,16.69 v30.46,16.69 J4.B7
  Bottom 0.152: v30.47,16.69 v30.47,17.7
DP
  Top 0.152: D7.3 26.77,12.34 26.77,16.74 27.22,17.19 J4.A6 30.92,17.19 31.17,17.44 31.17,17.94 30.87,18.24 29.34,18.24 J4.B6
EN_DRV  (via drill 0.3)
  Top 0.152: IC1.17 12.87,12.94 v12.97,12.84 | IC4.5 16.76,7.75 16.79,7.75 17.26,7.28 v18.62,7.28
  Bottom 0.152: v12.97,12.84 16.17,9.64 19.07,9.64 19.37,9.34 19.37,8.02 v18.62,7.28
GND  (via drill 0.3)
  Top 0.152: S1.4 S1.1 30.3,27.18 C7.2 | J4.A12 28.12,20.79 27.82,20.49 R3.2 | R2.1 27.92,14.69 28.22,14.39 J4.B12 J4.A1 | C6.2 31.54,9 S2.4 S2.1 | C2.2 9.36,4.13 S4.4 S4.1 | IC1.64 24.84,13.74 24.21,14.37 11.72,14.37 11.09,13.74 IC1.63 | v3.27,25.52 3.82,26.07 3.82,26.12 4.59,26.89 5.4,26.89 S3.4 S3.1 8.28,29.89 C5.2 | IC1.61 18.07,20.74 | 18.07,20.74 IC1.71 | IC1.61 IC1.67 | IC1.69 17.97,20.64 18.07,20.74 | IC1.73 IC1.61 | IC1.46 IC1.65
  Bottom 0.152: IC3.10 21.57,24.64 21.47,24.74 20.95,24.74 20.47,24.26 v20.47,23.72
  other vias: 23.37,11.74 23.17,10.14 27.57,13.74 19.67,15.22 9.27,13.42 9.87,15.12 4.07,16.12 3.17,12.12 7.47,13.62 5.07,24.92 18.77,23.62 23.27,23.22 22.97,18.62 23.77,20.82 9.43,10.88 22.73,2.68 18.13,4.08 13.33,2.98 13.33,7.98 15.33,12.28 27.17,8.52 7.83,10.48 25.97,2.54 24.47,1.94 12.57,1.34 11.77,1.34 14.57,20.22 15.07,20.92 14.87,18.72 25.07,12.84 24.47,12.84 13.17,23.02 12.07,23.02 12.47,26.82 13.27,26.82 14.07,26.82 9.77,29.92 8.47,28.22 26.87,28.92
  pour Bottom: 4.57,37.84 29.67,37.84 38.37,29.14 38.37,-1.26 36.27,-3.36 1.87,-3.36 -4.83,3.34 -4.83,28.44
  pour Top: 1.77,38.44 30.97,38.44 40.07,29.34 40.07,-0.96 36.67,-4.36 0.37,-4.36 -2.53,-1.46 -2.53,34.04 0.67,37.24
IMU_INT1  (via drill 0.3)
  Top 0.152: IC1.11 11.55,18.19 14.39,21.03 14.39,23.29 16.8,25.7 21.93,25.7 22.09,25.54 v23.67,25.54
  Bottom 0.152: IC3.16 23.97,25.24 v23.67,25.54
IMU_INT2  (via drill 0.3)
  Top 0.152: IC1.10 11.97,19.04 13.67,20.74 v13.67,21.34
  Bottom 0.152: v13.67,21.34 14.57,21.34 15.77,22.54 17.47,22.54 18.27,21.74 18.27,21.04 18.61,20.7 22.76,20.7 23.6,21.53 23.6,22.17 25.07,23.64 25.07,25.71 24.36,26.41 IC3.1
IN_DRV  (via drill 0.3)
  Top 0.152: IC1.16 12.02,12.99 v12.07,12.94 | IC4.4 17.95,8.34 18.24,8.06 v18.69,8.06
  Bottom 0.152: v12.07,12.94 12.07,12.44 12.67,11.84 13.54,11.84 16.04,9.34 18.39,9.34 18.69,9.04 v18.69,8.06
LEDA
  Bottom 0.152: CON1.3 20.42,3.99 20.77,4.35 R11.2
LEDK  (via drill 0.3)
  Top 0.152: Q1.3 15.22,4.74 15.67,4.74 16.06,5.14 16.06,5.7 v16.27,5.91
  Bottom 0.152: CON1.2 21.12,4.39 21.47,4.74 21.47,5.94 21.3,6.11 16.48,6.11 v16.27,5.91
MISO  (via drill 0.3)
  Top 0.152: IC1.33 25.52,16.49 25.77,16.24 25.77,13.04 v25.72,13
  Bottom 0.152: IC5.2 14.33,7.78 13.46,8.65 13.46,9.64 13.47,9.64 10.47,12.64 8.07,12.64 | J3.P7 8.07,12.64 | 8.07,12.64 8.07,14.94 8.92,15.8 14.81,15.8 15.47,15.14 15.47,14.14 15.87,13.74 20.67,13.74 21.12,13.29 R6.2 21.77,12.59 R22.1 21.77,12.54 23.17,11.14 24.97,11.14 25.57,11.74 25.57,12.84 v25.72,13
MOSI  (via drill 0.3)
  Top 0.152: IC1.31 22.52,14.79 21.67,15.64 v21.67,17.3
  Bottom 0.152: CON1.10 15.52,3.79 15.07,4.24 7.87,4.24 7.27,4.84 IC5.5 4.77,7.74 4.77,15.03 5.07,15.34 5.07,16.55 5.57,17.04 J3.P3 18.67,17.04 18.92,17.29 R5.2 21.62,17.29 21.67,17.34 21.97,17.04 | 21.97,17.04 R21.1 | 21.97,17.04 21.92,17.04 v21.67,17.3
N$1
  Top 0.152: C1.2 16.67,11.1 IC4.1
N$2
  Top 0.152: IC2.1 5.02,22.39 4.77,22.14 4.77,20.64 4.82,20.59 | IC2.3 5.72,20.44 4.97,20.44 4.82,20.59 | 4.82,20.59 C4.1 4.62,19.74 D6.1 4.72,18.94 Q2.2
N$3
  Top 0.152: J4.A5 27.77,16.19 R2.2
N$7
  Top 0.152: U1.5 6.62,12.04 R13.2
N$9
  Top 0.152: R3.1 J4.B5
N$10
  Top 0.152: Q1.1 13.22,6 R10.2 R8.1
N$14
  Top 0.152: R14.2 2.23,19.06 2.23,17.91 SJ2.2 1.88,17.91 1.44,17.46 1.44,15.09 R15.1
N$16
  Top 0.152: SJ1.2 2.96,13.79 R15.2
PIN_LED
  Top 0.152: R8.2 11.02,4.39 13.16,2.25 21.17,2.25 22.27,3.34 22.27,5.74 23.27,6.74 24.77,6.74 25.86,7.84 25.86,12.15 25.67,12.34 24.3,12.34 23.92,12.72 IC1.30
PPG_INT  (via drill 0.3)
  Top 0.152: IC1.36 25.37,19.04 25.77,18.64 v25.86,18.64
  Bottom 0.152: TP8.TP 27.27,18.64 v25.86,18.64
RESET  (via drill 0.3)
  Top 0.152: 7.37,30.8 S3.2 S3.3 4.71,28.03 R18.1 | v13.17,26.04 23.57,26.04 24.22,26.69 IC1.45 26.12,26.69 v26.67,27.24 | v6.27,30.14 6.71,30.14 7.37,30.8 | 7.37,30.8 C5.1
  Bottom 0.152: v6.27,30.14 7.77,30.14 10.18,27.74 10.77,27.74 12.47,26.04 v13.17,26.04 | v26.67,27.24 26.77,27.14 TP9.TP
RX  (via drill 0.3)
  Top 0.152: IC1.40 26.47,22.44 26.77,22.74 v26.77,23.84
  Bottom 0.152: TP11.TP 28.07,22.54 v26.77,23.84
SCK  (via drill 0.3)
  Top 0.152: IC1.32 22.81,15.64 v22.77,15.69
  Bottom 0.152: CON1.9 16.22,3.69 15.37,4.54 9.23,4.54 IC5.6 5.07,8.7 5.07,14.45 5.47,14.84 J3.P5 7.37,14.84 8.67,16.14 15.17,16.14 15.94,15.37 15.94,14.35 16.14,14.14 17.77,14.14 18.32,14.69 R4.2 21.33,14.74 R12.1 v22.77,15.69
SCL  (via drill 0.3)
  Top 0.152: 12.07,16.49 19.42,16.49 22.57,19.65 22.57,22.45 21.72,23.3 v21.72,25.2 | 12.07,16.49 IC1.13 | 12.07,16.49 12.07,15.47 12.24,15.3 v14.47,15.3 | IC4.2 17.36,9.34 v18.17,10.15
  Bottom 0.152: v18.17,10.15 16.8,10.15 15.87,11.07 15.87,13.04 14.47,14.44 v14.47,15.3 | TP6.TP 19.97,23.51 19.96,23.51 19.96,24.56 IC3.8 21.57,25.24 21.61,25.2 v21.72,25.2
SDA  (via drill 0.3)
  Top 0.152: v21.18,21.23 v21.17,21.23 21.17,18.94 19.57,17.34 IC1.12 10.17,17.34 8.97,16.14 v8.97,14.94 | IC4.3 v18.16,8.84 v18.17,8.84
  Bottom 0.152: IC3.9 21.07,23.34 TP7.TP 21.57,21.24 v21.19,21.24 v21.18,21.23 | v8.97,14.94 13.97,9.94 13.97,8.74 14.27,8.44 15.69,8.44 16.09,8.84 v18.17,8.84
SS_FLASH  (via drill 0.3)
  Top 0.152: IC1.18 13.72,11.49 13.8,11.41 v13.8,10.87
  Bottom 0.152: IC5.1 15.07,9.6 v13.8,10.87
SS_SD  (via drill 0.3)
  Top 0.152: IC1.7 7.92,21.59 7.47,21.14 7.47,19.94 v8.47,18.94
  Bottom 0.152: 8.47,18.14 J3.P2 | 8.47,18.14 13.27,18.14 14.46,19.34 18.27,19.34 18.97,18.64 20.87,18.64 21.12,18.89 R7.2 R20.1 | 8.47,18.14 v8.47,18.94
SS_TFT  (via drill 0.3)
  Top 0.152: IC1.21 16.27,13.14 16.87,12.54 17.67,12.54 19.53,10.68 19.53,7.2 19,6.68 18.18,6.68 16.87,5.36 v16.87,3.84
  Bottom 0.152: v16.87,3.84 16.87,2.39 CON1.8
TFT_DC  (via drill 0.3)
  Top 0.152: IC1.22 17.12,13.19 17.27,13.04 17.77,13.04 19.83,10.98 19.83,7.01 19.2,6.37 18.4,6.37 17.57,5.54 v17.57,4.64
  Bottom 0.152: v17.57,4.64 17.57,2.39 CON1.7
TX  (via drill 0.3)
  Top 0.152: IC1.39 25.42,21.59 v25.87,21.14
  Bottom 0.152: v25.87,21.14 26.87,20.14 TP12.TP
VBAT  (via drill 0.3)
  Top 0.152: U1.3 | U1.3 9.27,9.44 9.27,9.94 | 9.27,9.94 C13.1 | 9.27,9.94 9.27,10.24 9.17,10.34 8.87,10.34 8.27,10.94 8.27,13.94 6.77,15.44 Q2.3 5.67,14.28 4.85,13.46 | 4.85,13.46 SJ1.1 | v2.97,14.67 4.24,14.67 4.85,14.06 4.85,13.46
  Bottom 0.152: TP5.TP 7.27,22.34 2.97,18.04 v2.97,14.67
VBUS  (via drill 0.3)
  Top 0.152: D6.2 6.62,18.94 Q2.1 6.67,17.49 | 6.67,17.49 R9.2 | D7.2 28.47,10.84 C9.1 | C10.1 30.12,10.45 C9.1 | v4.57,15.54 5.15,16.12 6.62,16.12 8.57,14.17 8.57,12.69 U1.4 9.62,11.64 C14.1 11.07,11.64 11.37,11.34 11.37,8.94 10.87,8.44 10.86,8.45 8.66,8.45 8.36,8.15 8.36,6.62 13.04,1.94 23.32,1.94 23.92,2.54 R1.2 25.06,5.49 25.06,6.41 26.17,7.52 26.17,8.74 26.67,9.24 27.87,9.24 27.99,9.36 28.01,9.36 28.87,10.22 C9.1 | v5.52,18.2 6.22,17.49 6.67,17.49
  Bottom 0.152: v4.57,15.54 4.57,15.91 4.57,17.25 v5.52,18.2
VIBE_OUT+  (via drill 0.3)
  Top 0.152: IC4.9 22.67,9.34 23.17,8.84 v24.77,8.84
  Bottom 0.152: v24.77,8.84 24.27,8.34 TP1.TP
VIBE_OUT-  (via drill 0.3)
  Top 0.152: IC4.7 22.37,8.34 23.07,7.64 v24.77,7.64
  Bottom 0.152: v24.77,7.64 23.39,6.27 TP2.TP
VUSB  (via drill 0.3)
  Top 0.152: 30.07,15.25 31.47,16.65 31.47,18.23 30.01,19.69 J4.B4 J4.A9 | 30.07,15.25 30.01,15.19 J4.B9 J4.A4 | 30.07,15.25 31.06,15.25 v32.07,14.24 | R1.1 19.62,4.14 v21.62,4.14
  Bottom 0.152: v32.07,14.24 29.37,11.54 29.37,6.74 26.77,4.14 v21.62,4.14

### Text on the board
Bottom: GND | B+ | GND | 3V3 | RST | Rx | Tx | PPG
tSilk: 3V3 | GND | SS | MOSI | MISO | SCK | 32 | 33 | 25 | 4 | GND | GND | GND | IO0 | SDA | SCL | 35 | 2 | 12 | 26 | 27 | 3V3 | 3V3 | GND | BAT | 5V | GND | RST
silk_bottom: 5 | 23 | 19 | 18 | 32 | 33 | 13 | 4 | GND | 3V3 | 3V3 | GND | GND | GND | GND | GND | GND | SDA | SCL | 35 | 2 | 12 | 14 | 15 | 3V3 | 3V3 | GND | BAT | USB | GND